# Altium schematic sheet Main.SchDoc
size A4; SheetNumber: 1; SheetTotal: 4
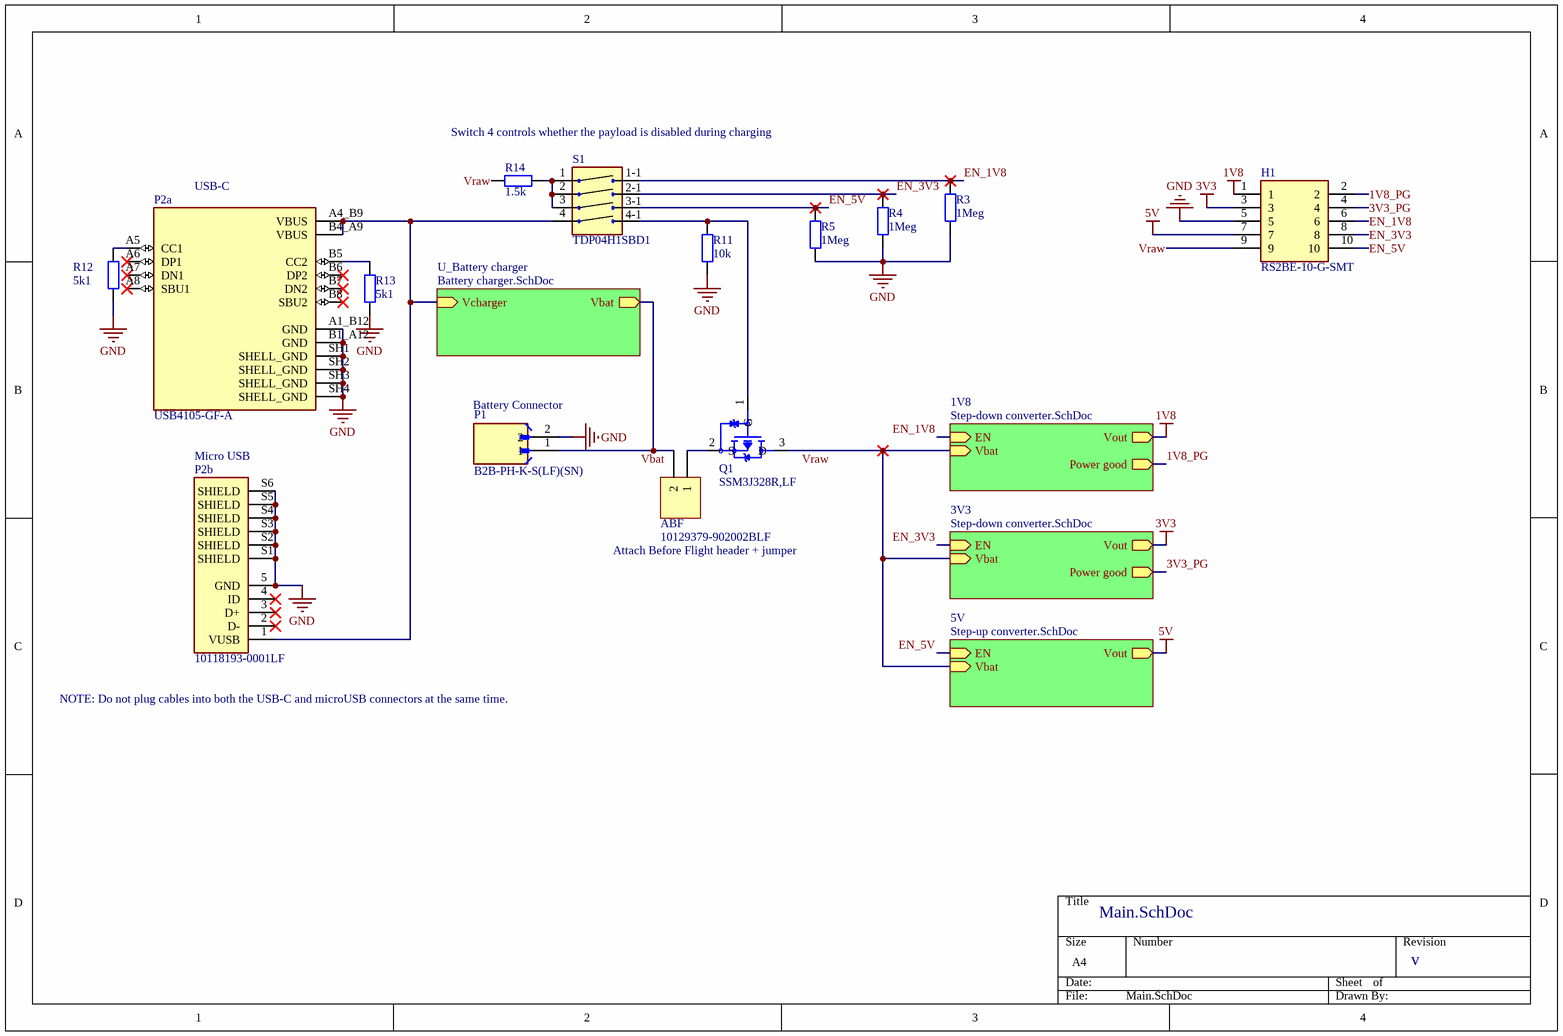
[diagram p0: Main.SchDoc]

## Parts
ABF  10129379-902002BLF  [ECE-600102STTH-RA]
H1  RS2BE-10-G-SMT  [RS2BE10GSMT]
P1  B2B-PH-K-S(LF)(SN)  [JST_B2B-PH-K-S(LF)(SN)]
P2a  USB4105-GF-A  [GCT_USB4105-GF-A]
P2b  10118193-0001LF  [AMPHENOL_10118193-0001LF]
Q1  SSM3J328R,LF  [SOT95P240X88-3N]
R3  1Meg  [0805]
R4  1Meg  [0805]
R5  1Meg  [0805]
R11  10k  [0805]
R12  5k1  [0805]
R13  5k1  [0805]
R14  1.5k  [0805]
S1  TDP04H1SBD1  [TDP04H1SBD1]

## Sub-sheets
1V8 = Step-down converter.SchDoc: EN (in), Vbat (in), Power good (out), Vout (out)  | R_FB1_Value: 200k; R_FB2_Value: 100k
3V3 = Step-down converter.SchDoc: EN (in), Vbat (in), Power good (out), Vout (out)  | R_FB1_Value: 910k; R_FB2_Value: 200k
5V = Step-up converter.SchDoc: EN (in), Vbat (in), Vout (out)  | R_FB1_Value: 910k; R_FB2_Value: 100k
U_Battery charger = Battery charger.SchDoc: Vbat (out), Vcharger (in)

## Nets
1V8: H1.1 ; sheet 1V8/Vout
3V3: H1.3 ; sheet 3V3/Vout
5V: H1.7 ; sheet 5V/Vout
GND: H1.5 P1.2 P2a.A1_B12(GND) P2a.B1_A12(GND) P2a.SH1(SHELL_GND) P2a.SH2(SHELL_GND) P2a.SH3(SHELL_GND) P2a.SH4(SHELL_GND) P2b.5(GND) P2b.S1(SHIELD) P2b.S2(SHIELD) P2b.S3(SHIELD) P2b.S4(SHIELD) P2b.S5(SHIELD) P2b.S6(SHIELD) R3.2 R4.2 R5.2 R11.1 R12.2 R13.1
1V8_PG: H1.2 ; sheet 1V8/Power good
3V3_PG: H1.4 ; sheet 3V3/Power good
EN_1V8: H1.6 R3.1 S1.8(1-1) ; sheet 1V8/EN
EN_3V3: H1.8 R4.1 S1.7(2-1) ; sheet 3V3/EN
EN_5V: H1.10 R5.1 S1.6(3-1) ; sheet 5V/EN
Vbat: ABF.2 P1.1 ; sheet U_Battery charger/Vbat
Vraw: H1.9 Q1.3(D) R14.1 ; sheet 1V8/Vbat, sheet 3V3/Vbat, sheet 5V/Vbat
NetABF_1: ABF.1 Q1.2(S)
NetP2a_A4_B9: P2a.A4_B9(VBUS) P2a.B4_A9(VBUS) P2b.1(VUSB) S1.4 ; sheet U_Battery charger/Vcharger
NetP2a_A5: P2a.A5(CC1) R12.1
NetP2a_B5: P2a.B5(CC2) R13.2
NetQ1_1: Q1.1(G) R11.2 S1.5(4-1)
NetR14_2: R14.2 S1.1 S1.2 S1.3

Not connected (* = marked no-connect by the designer): P2a A6(DP1)* A7(DN1)* A8(SBU1)* B6(DP2)* B7(DN2)* B8(SBU2)*; P2b 2(D-)* 3(D+)* 4(ID)*

## Notes on the sheet
- Switch 4 controls whether the payload is disabled during charging
- (near P2a) USB-C
- (near P1) Battery Connector
- (near P2b) Micro USB
- Attach Before Flight header + jumper
- NOTE: Do not plug cables into both the USB-C and microUSB connectors at the same time.
- v

## Library data of the parts
ABF = Header 2: Short Before Flight
H1 = RS2BE-10-G-SMT: Receptacle Strip 10P 2.54mm Pitch SMT; Manufacturer_Name: Adam Tech; Geometry.Height: 5.05mm; Manufacturer_Part_Number: RS2BE-10-G-SMT; Mouser Part Number: *; Mouser Price/Stock: *; Arrow Part Number: *; Arrow Price/Stock: *; Datasheet Link: *
P1 = B2B-PH-K-S(LF)(SN): Connector Header Through Hole 2 position 0.079 (2.00mm); MF: JST; SnapEDA_Link: https://www.snapeda.com/parts/B2B-PH-K-S%20(LF)(SN)/JST/view-part/?ref=snap; Package: None; Value: *; MP: B2B-PH-K-S (LF)(SN); Check_prices: https://www.snapeda.com/parts/B2B-PH-K-S%20(LF)(SN)/JST/view-part/?ref=eda
P2a = USB4105-GF-A: USB-C (USB TYPE-C) USB 2.0 Receptacle Connector 24 (16+8 Dummy) Position Surface Mount, Right Angle; Through Hole; MF: GCT; SnapEDA_Link: https://www.snapeda.com/parts/USB4105-GF-A/Global+Connector+Technology/view-part/?ref=snap; Package: None; Value: *; MP: USB4105-GF-A; Check_prices: https://www.snapeda.com/parts/USB4105-GF-A/Global+Connector+Technology/view-part/?ref=eda
P2b = 10118193-0001LF: Micro USB 2.0, Input Output Connectors, B TYPE RECEPTACLE; MF: Amphenol ICC; Value: *; MP: 10118193-0001LF; Package: None; Check_prices: https://www.snapeda.com/parts/10118193-0001LF/Amphenol+FCI/view-part/?ref=eda; Purchase-URL: https://pricing.snapeda.com/search/part/10118193-0001LF/?ref=eda; Price: None; Availability: In Stock; SnapEDA_Link: https://www.snapeda.com/parts/10118193-0001LF/Amphenol+FCI/view-part/?ref=snap
Q1 = SSM3J328R,LF: P-Channel 20V 6A _Ta_ 1W _Ta_ Surface Mount SOT-23F; MF: Toshiba; MP: SSM3J328R,LF; SnapEDA_Link: https://www.snapeda.com/parts/SSM3J328R,LF/Toshiba%20Semiconductor%20and%20Storage/view-part/214715/?ref=snap; Availability: Unavailable; Package: SOT-23 Toshiba; Value: *; Price: None
R3-R5 R12 R13 = Res 0805: Resistor; Value: 100k; IsInLabBook: Yes
R11 R14 = Res 0805: Resistor; IsInLabBook: Yes
  R11: Value: 10k
  R14: Value: 1.5k
S1 = TDP04H1SBD1: Switch; Manufacturer_Name: C & K COMPONENTS; Datasheet Link: https://www.ckswitches.com/media/1330/tdp.pdf; Height: 4.4mm; Manufacturer_Part_Number: TDP04H1SBD1; Mouser Part Number: 611-TDP04H1SBD1; Mouser Price/Stock: https://www.mouser.co.uk/ProductDetail/CK/TDP04H1SBD1?qs=LUL%252B3%2F1oFk7o6Dk5%252BAVXHw%3D%3D; Arrow Part Number: TDP04H1SBD1; Arrow Price/Stock: https://www.arrow.com/en/products/tdp04h1sbd1/ck?region=nac